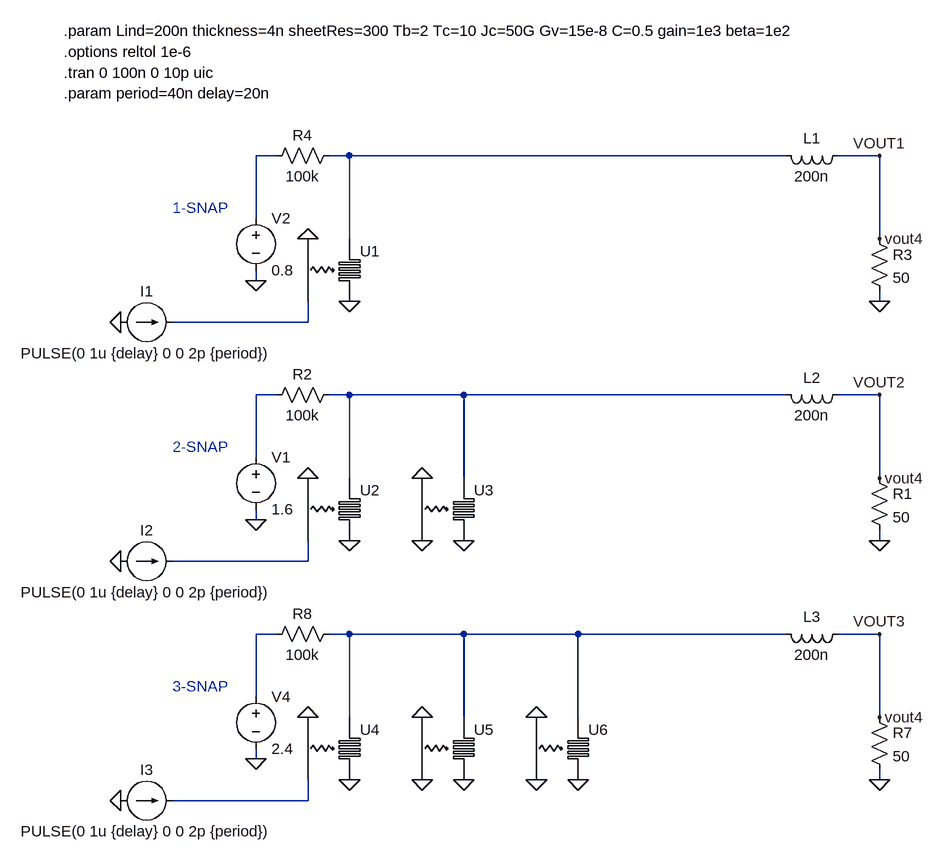
[diagram p0: schematic SNAP-thermal.asc]
SNAP-thermal.asc, the LTspice schematic file:
Version 4
SHEET 1 3764 1536
WIRE 1552 112 1520 112
WIRE 1664 112 1632 112
WIRE 2336 112 1664 112
WIRE 2480 112 2416 112
WIRE 1520 208 1520 112
WIRE 1664 240 1664 112
WIRE 2480 240 2480 112
WIRE 1520 304 1520 288
WIRE 2480 336 2480 320
WIRE 1600 368 1600 336
WIRE 1600 368 1392 368
WIRE 1552 480 1520 480
WIRE 1664 480 1632 480
WIRE 1840 480 1664 480
WIRE 2336 480 1840 480
WIRE 2480 480 2416 480
WIRE 1520 576 1520 480
WIRE 1664 608 1664 480
WIRE 1840 608 1840 480
WIRE 2480 608 2480 480
WIRE 1520 672 1520 656
WIRE 2480 704 2480 688
WIRE 1600 736 1600 704
WIRE 1600 736 1392 736
WIRE 1552 848 1520 848
WIRE 1664 848 1632 848
WIRE 1840 848 1664 848
WIRE 2016 848 1840 848
WIRE 2336 848 2016 848
WIRE 2480 848 2416 848
WIRE 1520 944 1520 848
WIRE 1664 976 1664 848
WIRE 1840 976 1840 848
WIRE 2016 976 2016 848
WIRE 2480 976 2480 848
WIRE 1520 1040 1520 1024
WIRE 2480 1072 2480 1056
WIRE 1600 1104 1600 1072
WIRE 1600 1104 1392 1104
FLAG 2480 1072 0
FLAG 1520 1040 0
FLAG 2480 976 vout4
FLAG 1664 1072 0
FLAG 1600 976 0
FLAG 1776 1072 0
FLAG 1840 1072 0
FLAG 1776 976 0
FLAG 1952 1072 0
FLAG 2016 1072 0
FLAG 1952 976 0
FLAG 1312 1104 0
FLAG 2480 704 0
FLAG 1520 672 0
FLAG 2480 608 vout4
FLAG 1664 704 0
FLAG 1600 608 0
FLAG 1776 704 0
FLAG 1840 704 0
FLAG 1776 608 0
FLAG 1312 736 0
FLAG 2480 336 0
FLAG 1520 304 0
FLAG 2480 240 vout4
FLAG 1664 336 0
FLAG 1600 240 0
FLAG 1312 368 0
FLAG 2480 112 VOUT1
FLAG 2480 480 VOUT2
FLAG 2480 848 VOUT3
SYMBOL res 2464 960 R0
SYMATTR InstName R7
SYMATTR Value 50
SYMBOL voltage 1520 928 R0
WINDOW 123 0 0 Left 0
WINDOW 39 0 0 Left 0
SYMATTR InstName V4
SYMATTR Value 2.4
SYMBOL res 1648 832 R90
WINDOW 0 0 56 VBottom 2
WINDOW 3 32 56 VTop 2
SYMATTR InstName R8
SYMATTR Value 100k
SYMBOL snspd_photon_port 1664 1024 R0
WINDOW 39 -10 32 Invisible 2
SYMATTR SpiceLine Lind={Lind} thickness={thickness} sheetRes={sheetRes} Tb={Tb} Tc={Tc}  Jc={Jc} Gv={Gv} C={C} gain= {gain} beta = {beta}
SYMATTR InstName U4
SYMBOL snspd_photon_port 1840 1024 R0
WINDOW 39 -10 32 Invisible 2
SYMATTR SpiceLine Lind={Lind} thickness={thickness} sheetRes={sheetRes} Tb={Tb} Tc={Tc}  Jc={Jc} Gv={Gv} C={C} gain= {gain} beta = {beta}
SYMATTR InstName U5
SYMBOL snspd_photon_port 2016 1024 R0
WINDOW 39 -10 32 Invisible 2
SYMATTR SpiceLine Lind={Lind} thickness={thickness} sheetRes={sheetRes} Tb={Tb} Tc={Tc}  Jc={Jc} Gv={Gv} C={C} gain= {gain} beta = {beta}
SYMATTR InstName U6
SYMBOL ind 2432 832 R90
WINDOW 0 5 56 VBottom 2
WINDOW 3 32 56 VTop 2
SYMATTR InstName L3
SYMATTR Value 200n
SYMBOL current 1312 1104 R270
WINDOW 0 32 40 VTop 2
WINDOW 3 -32 40 VBottom 2
SYMATTR InstName I3
SYMATTR Value PULSE(0 1u {delay} 0 0 2p {period})
SYMBOL res 2464 592 R0
SYMATTR InstName R1
SYMATTR Value 50
SYMBOL voltage 1520 560 R0
WINDOW 123 0 0 Left 0
WINDOW 39 0 0 Left 0
SYMATTR InstName V1
SYMATTR Value 1.6
SYMBOL res 1648 464 R90
WINDOW 0 0 56 VBottom 2
WINDOW 3 32 56 VTop 2
SYMATTR InstName R2
SYMATTR Value 100k
SYMBOL snspd_photon_port 1664 656 R0
WINDOW 39 -10 32 Invisible 2
SYMATTR SpiceLine Lind={Lind} thickness={thickness} sheetRes={sheetRes} Tb={Tb} Tc={Tc}  Jc={Jc} Gv={Gv} C={C} gain= {gain} beta = {beta}
SYMATTR InstName U2
SYMBOL snspd_photon_port 1840 656 R0
WINDOW 39 -10 32 Invisible 2
SYMATTR SpiceLine Lind={Lind} thickness={thickness} sheetRes={sheetRes} Tb={Tb} Tc={Tc}  Jc={Jc} Gv={Gv} C={C} gain= {gain} beta = {beta}
SYMATTR InstName U3
SYMBOL ind 2432 464 R90
WINDOW 0 5 56 VBottom 2
WINDOW 3 32 56 VTop 2
SYMATTR InstName L2
SYMATTR Value 200n
SYMBOL current 1312 736 R270
WINDOW 0 32 40 VTop 2
WINDOW 3 -32 40 VBottom 2
SYMATTR InstName I2
SYMATTR Value PULSE(0 1u {delay} 0 0 2p {period})
SYMBOL res 2464 224 R0
SYMATTR InstName R3
SYMATTR Value 50
SYMBOL voltage 1520 192 R0
WINDOW 123 0 0 Left 0
WINDOW 39 0 0 Left 0
SYMATTR InstName V2
SYMATTR Value 0.8
SYMBOL res 1648 96 R90
WINDOW 0 0 56 VBottom 2
WINDOW 3 32 56 VTop 2
SYMATTR InstName R4
SYMATTR Value 100k
SYMBOL snspd_photon_port 1664 288 R0
WINDOW 39 -10 32 Invisible 2
SYMATTR SpiceLine Lind={Lind} thickness={thickness} sheetRes={sheetRes} Tb={Tb} Tc={Tc}  Jc={Jc} Gv={Gv} C={C} gain= {gain} beta = {beta}
SYMATTR InstName U1
SYMBOL ind 2432 96 R90
WINDOW 0 5 56 VBottom 2
WINDOW 3 32 56 VTop 2
SYMATTR InstName L1
SYMATTR Value 200n
SYMBOL current 1312 368 R270
WINDOW 0 32 40 VTop 2
WINDOW 3 -32 40 VBottom 2
SYMATTR InstName I1
SYMATTR Value PULSE(0 1u {delay} 0 0 2p {period})
TEXT 1224 -16 Left 2 !.tran 0 100n 0 10p uic
TEXT 1224 -48 Left 2 !.options reltol 1e-6
TEXT 1392 928 Left 2 ;3-SNAP
TEXT 1224 -80 Left 2 !.param Lind=200n thickness=4n sheetRes=300 Tb=2 Tc=10 Jc=50G Gv=15e-8 C=0.5 gain=1e3 beta=1e2
TEXT 1224 16 Left 2 !.param period=40n delay=20n
TEXT 1392 560 Left 2 ;2-SNAP
TEXT 1392 192 Left 2 ;1-SNAP

The netlist it stands for:
* SNAP-thermal.asc
R7 VOUT3 0 50
V4 N007 0 2.4
R8 N008 N007 100k
XU4 0 N009 N008 0 nanowireDynTherm Lind={Lind} thickness={thickness} sheetRes={sheetRes} Tb={Tb} Tc={Tc}  Jc={Jc} Gv={Gv} C={C} gain= {gain} beta = {beta}  ; pins gate-in photon-out ? ?
XU5 0 0 N008 0 nanowireDynTherm Lind={Lind} thickness={thickness} sheetRes={sheetRes} Tb={Tb} Tc={Tc}  Jc={Jc} Gv={Gv} C={C} gain= {gain} beta = {beta}  ; pins gate-in photon-out ? ?
XU6 0 0 N008 0 nanowireDynTherm Lind={Lind} thickness={thickness} sheetRes={sheetRes} Tb={Tb} Tc={Tc}  Jc={Jc} Gv={Gv} C={C} gain= {gain} beta = {beta}  ; pins gate-in photon-out ? ?
L3 VOUT3 N008 200n
I3 0 N009 PULSE(0 1u {delay} 0 0 2p {period})
R1 VOUT3 0 50
V1 N004 0 1.6
R2 N005 N004 100k
XU2 0 N006 N005 0 nanowireDynTherm Lind={Lind} thickness={thickness} sheetRes={sheetRes} Tb={Tb} Tc={Tc}  Jc={Jc} Gv={Gv} C={C} gain= {gain} beta = {beta}  ; pins gate-in photon-out ? ?
XU3 0 0 N005 0 nanowireDynTherm Lind={Lind} thickness={thickness} sheetRes={sheetRes} Tb={Tb} Tc={Tc}  Jc={Jc} Gv={Gv} C={C} gain= {gain} beta = {beta}  ; pins gate-in photon-out ? ?
L2 VOUT3 N005 200n
I2 0 N006 PULSE(0 1u {delay} 0 0 2p {period})
R3 VOUT3 0 50
V2 N001 0 0.8
R4 N002 N001 100k
XU1 0 N003 N002 0 nanowireDynTherm Lind={Lind} thickness={thickness} sheetRes={sheetRes} Tb={Tb} Tc={Tc}  Jc={Jc} Gv={Gv} C={C} gain= {gain} beta = {beta}  ; pins gate-in photon-out ? ?
L1 VOUT3 N002 200n
I1 0 N003 PULSE(0 1u {delay} 0 0 2p {period})
.tran 0 100n 0 10p uic
.options reltol 1e-6
* 3-SNAP
.param Lind=200n thickness=4n sheetRes=300 Tb=2 Tc=10 Jc=50G Gv=15e-8 C=0.5 gain=1e3 beta=1e2
.param period=40n delay=20n
* 2-SNAP
* 1-SNAP
.lib snspd.lib
.backanno
.end